# EAGLE design Dashboard_V3 (EAGLE 8.4.1)
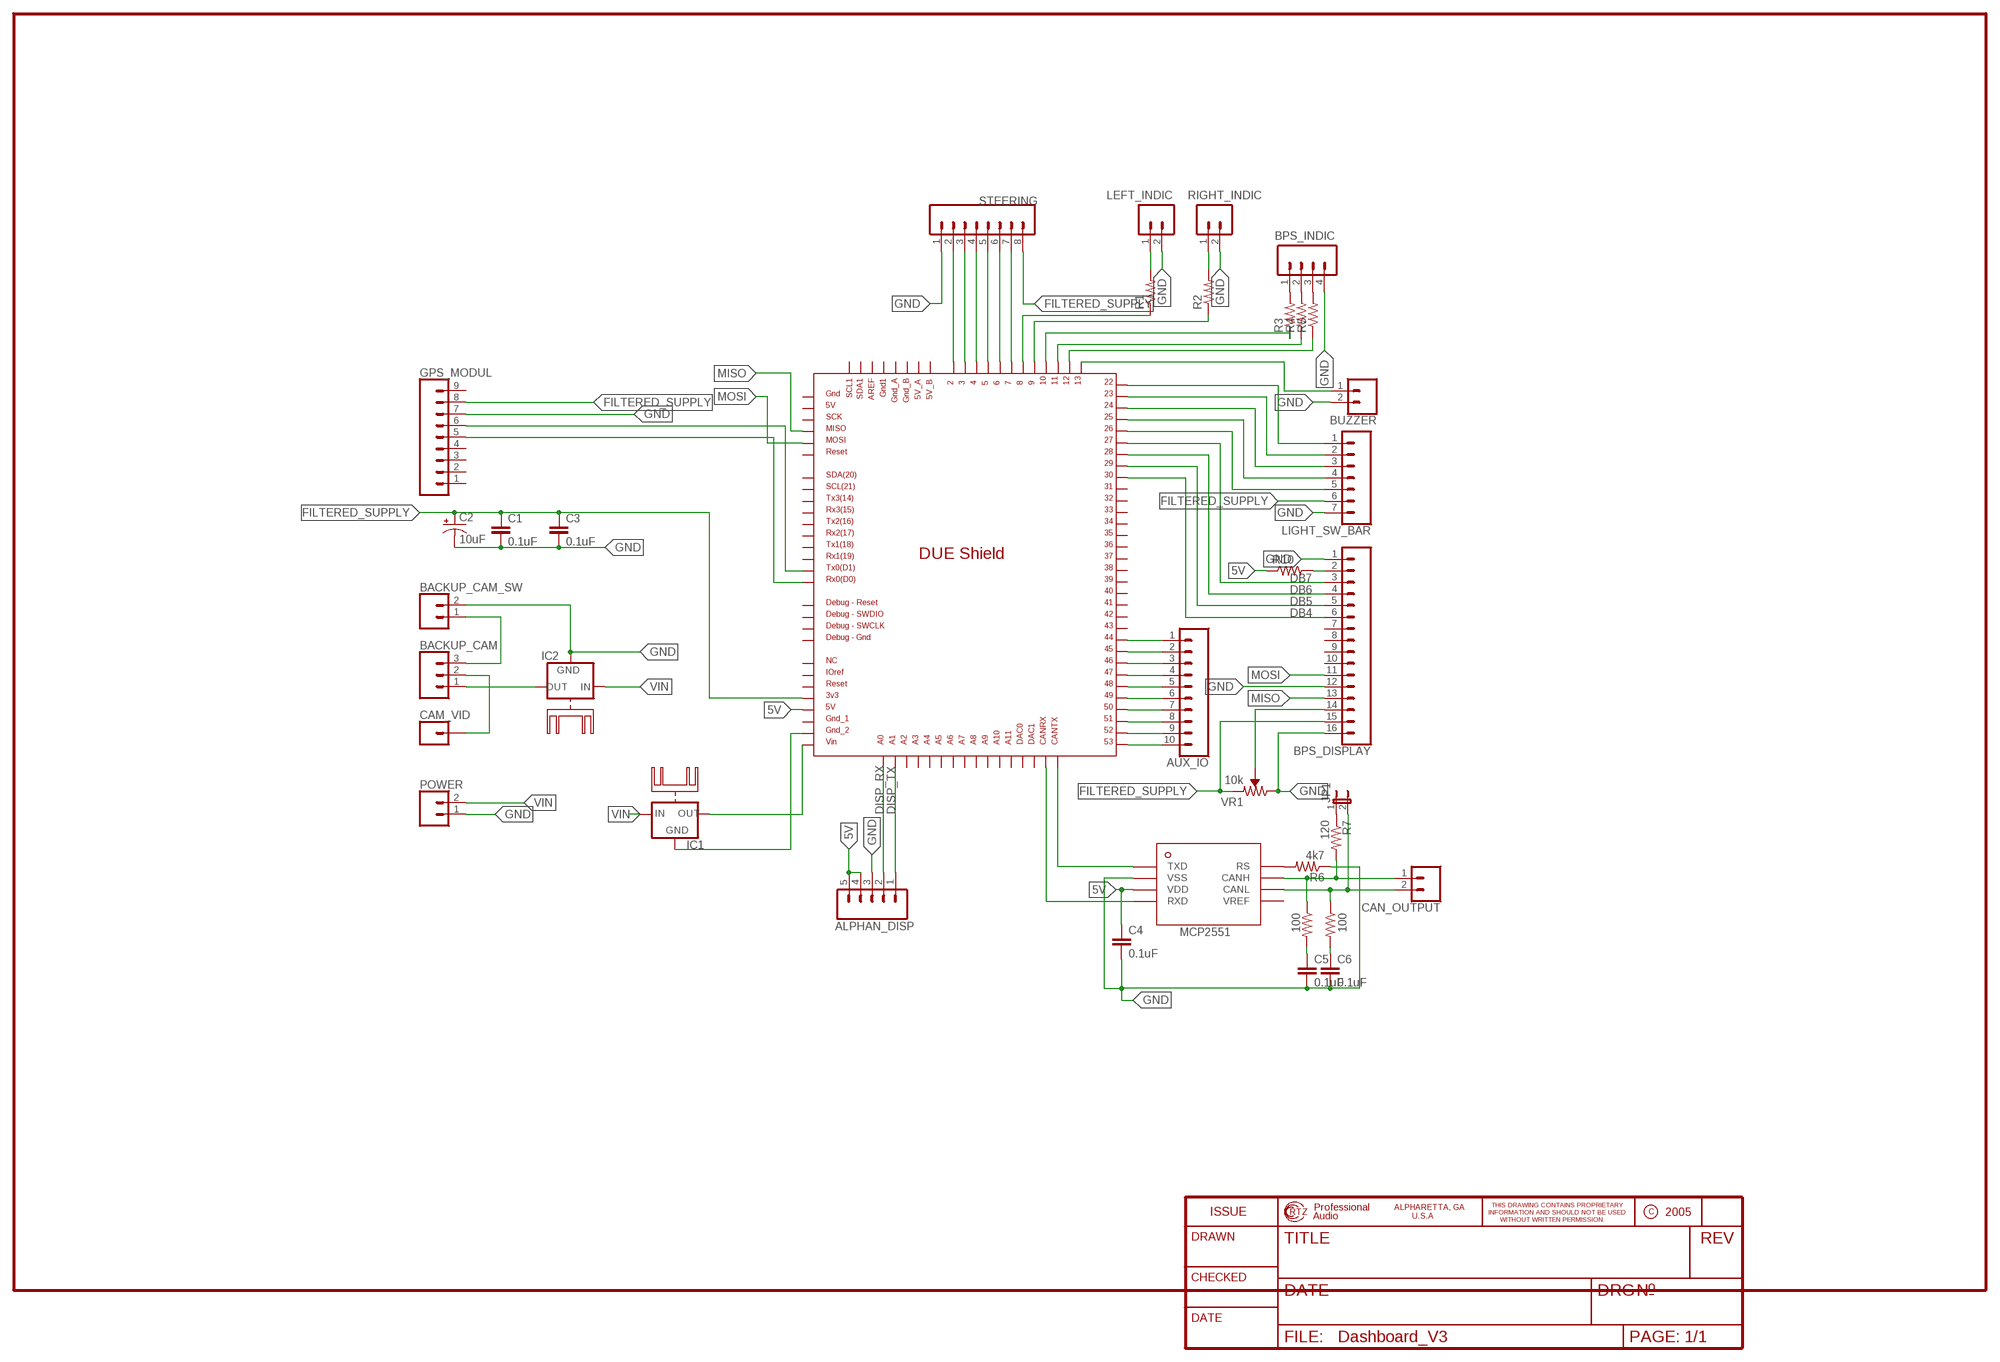
[diagram p0: schematic, sheet 1]

## Parts
ALPHAN_DISP  CONN_05  [1X05]
AUX_IO  CONN_10"  [1X10]
BACKUP_CAM  CONN_03  [1X03]
BACKUP_CAM_SW  CONN_02  [1X02]
BPS_DISPLAY  CONN_16  [1X16]
BPS_INDIC  CONN_04  [1X04]
BUZZER  CONN_02  [1X02]
C1  0.1uF  C2.5/6  [C2.5-6]
C2  10uF  CPOL-USE5-6  [E5-6]
C3  0.1uF  C2.5/6  [C2.5-6]
C4  0.1uF  C2.5/6  [C2.5-6]
C5  0.1uF  C2.5/6  [C2.5-6]
C6  0.1uF  C2.5/6  [C2.5-6]
CAM_VID  CONN_01  [1X01]
CAN_OUTPUT  CONN_025MM  [SCREWTERMINAL-5MM-2]
GPS_MODUL  CONN_09  [1X09]
IC1  78XXH  [78XXH]
IC2  78XXH  [78XXH]
JP1  JP1E  [JP1]
LEFT_INDIC  CONN_02  [1X02]
LIGHT_SW_BAR  CONN_07  [1X07]
POWER  CONN_02  [1X02]
R1  R-US_M0805  [M0805]
R2  R-US_M0805  [M0805]
R3  R-US_M0805  [M0805]
R4  R-US_M0805  [M0805]
R5  R-US_M0805  [M0805]
R6  4k7  R-US_R0805  [R0805]
R7  120  R-US_R0805  [R0805]
R8  100  R-US_R0805  [R0805]
R9  100  R-US_R0805  [R0805]
R10  R-US_R0805  [R0805]
RIGHT_INDIC  CONN_02  [1X02]
STEERING  CONN_08"  [1X08]
U$1  DUE(NORMAL)  [DUE(NORMAL)]
U$2  MCP2551  [SOIC-8]
VR1  10k  TRIMPOT-PTH-10MM-KNOB-1/2W-10%  [TRIMPOT-PTH-3386U]

## Nets
5V: ALPHAN_DISP.4 ALPHAN_DISP.5 C4.1 R10.1 U$1.5V U$2.VDD
CAM_VID: BACKUP_CAM.2 CAM_VID.1
DB4: BPS_DISPLAY.6 U$1.30
DB5: BPS_DISPLAY.5 U$1.29
DB6: BPS_DISPLAY.4 U$1.28
DB7: BPS_DISPLAY.3 U$1.27
DISP_RX: ALPHAN_DISP.2 U$1.A0
DISP_TX: ALPHAN_DISP.1 U$1.A1
FILTERED_SUPPLY: BPS_DISPLAY.15 C1.1 C2.+ C3.1 GPS_MODUL.8 LIGHT_SW_BAR.6 STEERING.8 U$1.3V3 VR1.1(CCW)
GND: ALPHAN_DISP.3 BACKUP_CAM_SW.2 BPS_DISPLAY.1 BPS_DISPLAY.12 BPS_DISPLAY.16 BPS_INDIC.4 BUZZER.2 C1.2 C2.- C3.2 C4.2 C5.2 C6.2 GPS_MODUL.7 IC2.GND LEFT_INDIC.2 LIGHT_SW_BAR.7 POWER.1 R6.1 RIGHT_INDIC.2 STEERING.1 U$2.VSS VR1.3(CW)
MISO: BPS_DISPLAY.13 U$1.MISO_ICSP
MOSI: BPS_DISPLAY.11 U$1.MOSI_ICSP
N$1: IC1.OUT U$1.VIN
N$2: IC1.GND U$1.GND_2
N$3: BACKUP_CAM.1 IC2.OUT
N$4: STEERING.2 U$1.2
N$5: BACKUP_CAM.3 BACKUP_CAM_SW.1
N$6: STEERING.3 U$1.3
N$7: STEERING.4 U$1.4
N$8: STEERING.5 U$1.5
N$9: STEERING.6 U$1.6
N$10: STEERING.7 U$1.7
N$12: LEFT_INDIC.1 R1.2
N$13: R2.2 RIGHT_INDIC.1
N$14: R1.1 U$1.8
N$15: R2.1 U$1.9
N$16: BPS_INDIC.1 R3.2
N$17: BPS_INDIC.2 R4.2
N$18: BPS_INDIC.3 R5.2
N$19: R3.1 U$1.10
N$20: R4.1 U$1.11
N$21: R5.1 U$1.12
N$22: U$1.CANTX U$2.TXD
N$23: U$1.CANRX U$2.RXD
N$24: R6.2 U$2.RS
N$25: JP1.1 R7.1
N$26: CAN_OUTPUT.1 R7.2 R8.1 U$2.CANH
N$27: CAN_OUTPUT.2 JP1.2 R9.1 U$2.CANL
N$28: C5.1 R8.2
N$29: C6.1 R9.2
N$30: BUZZER.1 U$1.13
N$31: GPS_MODUL.6 U$1.TX0
N$32: GPS_MODUL.5 U$1.RX0
N$33: BPS_DISPLAY.2 R10.2
N$34: BPS_DISPLAY.14 VR1.2(WIPER)
N$35: LIGHT_SW_BAR.1 U$1.22
N$36: LIGHT_SW_BAR.2 U$1.23
N$37: LIGHT_SW_BAR.3 U$1.24
N$38: LIGHT_SW_BAR.4 U$1.25
N$39: LIGHT_SW_BAR.5 U$1.26
N$40: AUX_IO.10 U$1.53
N$41: AUX_IO.9 U$1.52
N$42: AUX_IO.8 U$1.51
N$43: AUX_IO.7 U$1.50
N$44: AUX_IO.6 U$1.49
N$45: AUX_IO.5 U$1.48
N$46: AUX_IO.4 U$1.47
N$47: AUX_IO.3 U$1.46
N$48: AUX_IO.2 U$1.45
N$49: AUX_IO.1 U$1.44
VIN: IC1.IN IC2.IN POWER.2
Unconnected: BPS_DISPLAY.7 BPS_DISPLAY.8 BPS_DISPLAY.9 BPS_DISPLAY.10 GPS_MODUL.1 GPS_MODUL.2 GPS_MODUL.3 GPS_MODUL.4 GPS_MODUL.9 U$1.5V_A U$1.5V_B U$1.5V_ICSP U$1.31 U$1.32 U$1.33 U$1.34 U$1.35 U$1.36 U$1.37 U$1.38 U$1.39 U$1.40 U$1.41 U$1.42 U$1.43 U$1.A2 U$1.A3 U$1.A4 U$1.A5 U$1.A6 U$1.A7 U$1.A8 U$1.A9 U$1.A10 U$1.A11 U$1.AREF U$1.DAC0 U$1.DAC1 U$1.GND1 U$1.GND_1 U$1.GND_A U$1.GND_B U$1.GND_DEBUG U$1.GND_ICSP U$1.IOREF U$1.NC U$1.RESET U$1.RESET_DEBUG U$1.RESET_ICSP U$1.RX1 U$1.RX2 U$1.RX3 U$1.SCK_ICSP U$1.SCL U$1.SCL1 U$1.SDA U$1.SDA1 U$1.SWCLK_DEBUG U$1.SWDIO_DEBUG U$1.TX1 U$1.TX2 U$1.TX3 U$2.VREF

## Library data of the parts
ALPHAN_DISP = SparkFun-Connectors:CONN_05: Multi connection point. Often used as Generic Header-pin footprint for 0.1 inch spaced/style header connections On any of the 0.1 inch spaced packages, you can populate with these: Break Away Headers - Straight <https://www.sparkfun.com/products/116> (PRT-00116) Break Away Male Headers - Right Angle <https://www.sparkfun.com/products/553> (PRT-00553) Female Headers <https://www.sparkfun.com/products/115> (PRT-00115) Break Away Headers - Machine Pin <https://www.sparkfun.com/products/117> (PRT-00117) Break Away Female Headers - Swiss Machine Pin <https://www.sparkfun.com/products/743> (PRT-00743) For SCREWTERMINALS and SPRING TERMINALS visit here: Screw Terimnals on SparkFun.com <https://www.sparkfun.com/search/results?term=Screw+Terminals> (5mm/3.5mm/2.54mm spacing) This device is also useful as a general connection point to wire up your design to another part of your project. Our various solder wires solder well into these plated through hole pads. Hook-Up Wire - Assortment (Stranded, 22 AWG) <https://www.sparkfun.com/products/11375> (PRT-11375) Hook-Up Wire - Assortment (Solid Core, 22 AWG) <https://www.sparkfun.com/products/11367> (PRT-11367) View the entire wire category on our website here <https://www.sparkfun.com/categories/141> Special notes: Molex polarized connector foot print use with SKU : PRT-08231 with associated crimp pins and housings. 1MM SMD Version SKU: PRT-10208
AUX_IO = SparkFun-Connectors:CONN_10: Multi connection point. Often used as Generic Header-pin footprint for 0.1 inch spaced/style header connections On any of the 0.1 inch spaced packages, you can populate with these: Break Away Headers - Straight <https://www.sparkfun.com/products/116> (PRT-00116) Break Away Male Headers - Right Angle <https://www.sparkfun.com/products/553> (PRT-00553) Female Headers <https://www.sparkfun.com/products/115> (PRT-00115) Break Away Headers - Machine Pin <https://www.sparkfun.com/products/117> (PRT-00117) Break Away Female Headers - Swiss Machine Pin <https://www.sparkfun.com/products/743> (PRT-00743) Arduino Stackable Header - 10 Pin <https://www.sparkfun.com/products/11376> (PRT-11376) For SCREWTERMINALS and SPRING TERMINALS visit here: Screw Terimnals on SparkFun.com <https://www.sparkfun.com/search/results?term=Screw+Terminals> (5mm/3.5mm/2.54mm spacing) This device is also useful as a general connection point to wire up your design to another part of your project. Our various solder wires solder well into these plated through hole pads. Hook-Up Wire - Assortment (Stranded, 22 AWG) <https://www.sparkfun.com/products/11375> (PRT-11375) Hook-Up Wire - Assortment (Solid Core, 22 AWG) <https://www.sparkfun.com/products/11367> (PRT-11367) View the entire wire category on our website here <https://www.sparkfun.com/categories/141> Special notes: Molex polarized connector foot print use with SKU : PRT-08231 with associated crimp pins and housings. 1MM SMD Version SKU: PRT-10208 NOTES ON THE VARIANTS LOCK and LOCK_LONGPADS... This footprint was designed to help hold the alignment of a through-hole component (i.e. 6-pin header) while soldering it into place. You may notice that each hole has been shifted either up or down by 0.005 of an inch from it's more standard position (which is a perfectly straight line). This slight alteration caused the pins (the squares in the middle) to touch the edges of the holes. Because they are alternating, it causes a "brace" to hold the component in place. 0.005 has proven to be the perfect amount of "off-center" position when using our standard breakaway headers. Although looks a little odd when you look at the bare footprint, once you have a header in there, the alteration is very hard to notice. Also,if you push a header all the way into place, it is covered up entirely on the bottom side.; PROD_ID: CONN-11563
BACKUP_CAM = SparkFun-Connectors:CONN_03: Multi connection point. Often used as Generic Header-pin footprint for 0.1 inch spaced/style header connections On any of the 0.1 inch spaced packages, you can populate with these: Break Away Headers - Straight <https://www.sparkfun.com/products/116> (PRT-00116) Break Away Male Headers - Right Angle <https://www.sparkfun.com/products/553> (PRT-00553) Female Headers <https://www.sparkfun.com/products/115> (PRT-00115) Break Away Headers - Machine Pin <https://www.sparkfun.com/products/117> (PRT-00117) Break Away Female Headers - Swiss Machine Pin <https://www.sparkfun.com/products/743> (PRT-00743) Stackable Header - 3 Pin (Female, 0.1") <https://www.sparkfun.com/products/13875> (PRT-13875) For SCREWTERMINALS and SPRING TERMINALS visit here: Screw Terimnals on SparkFun.com <https://www.sparkfun.com/search/results?term=Screw+Terminals> (5mm/3.5mm/2.54mm spacing) This device is also useful as a general connection point to wire up your design to another part of your project. Our various solder wires solder well into these plated through hole pads. Hook-Up Wire - Assortment (Stranded, 22 AWG) <https://www.sparkfun.com/products/11375> (PRT-11375) Hook-Up Wire - Assortment (Solid Core, 22 AWG) <https://www.sparkfun.com/products/11367> (PRT-11367) View the entire wire category on our website here <https://www.sparkfun.com/categories/141> Special notes: Molex polarized connector foot print use with SKU : PRT-08232 with associated crimp pins and housings.
BACKUP_CAM_SW BUZZER LEFT_INDIC POWER RIGHT_INDIC = SparkFun-Connectors:CONN_02: Multi connection point. Often used as Generic Header-pin footprint for 0.1 inch spaced/style header connections On any of the 0.1 inch spaced packages, you can populate with these: Break Away Headers - Straight <https://www.sparkfun.com/products/116> (PRT-00116) Break Away Male Headers - Right Angle <https://www.sparkfun.com/products/553> (PRT-00553) Female Headers <https://www.sparkfun.com/products/115> (PRT-00115) Break Away Headers - Machine Pin <https://www.sparkfun.com/products/117> (PRT-00117) Break Away Female Headers - Swiss Machine Pin <https://www.sparkfun.com/products/743> (PRT-00743) For SCREWTERMINALS and SPRING TERMINALS visit here: Screw Terimnals on SparkFun.com <https://www.sparkfun.com/search/results?term=Screw+Terminals> (5mm/3.5mm/2.54mm spacing) This device is also useful as a general connection point to wire up your design to another part of your project. Our various solder wires solder well into these plated through hole pads. Hook-Up Wire - Assortment (Stranded, 22 AWG) <https://www.sparkfun.com/products/11375> (PRT-11375) Hook-Up Wire - Assortment (Solid Core, 22 AWG) <https://www.sparkfun.com/products/11367> (PRT-11367) View the entire wire category on our website here <https://www.sparkfun.com/categories/141> Special notes: Molex polarized connector foot print use with: PRT-08233 with associated crimp pins and housings. 2.54_SCREWTERM for use with PRT-10571. 3.5mm Screw Terminal footprints for PRT-08084 5mm Screw Terminal footprints for use with PRT-08432
BPS_DISPLAY = SparkFun-Connectors:CONN_16: Multi connection point. Often used as Generic Header-pin footprint for 0.1 inch spaced/style header connections On any of the 0.1 inch spaced packages, you can populate with these: Break Away Headers - Straight <https://www.sparkfun.com/products/116> (PRT-00116) Break Away Male Headers - Right Angle <https://www.sparkfun.com/products/553> (PRT-00553) Female Headers <https://www.sparkfun.com/products/115> (PRT-00115) Break Away Headers - Machine Pin <https://www.sparkfun.com/products/117> (PRT-00117) Break Away Female Headers - Swiss Machine Pin <https://www.sparkfun.com/products/743> (PRT-00743) For SCREWTERMINALS and SPRING TERMINALS visit here: Screw Terimnals on SparkFun.com <https://www.sparkfun.com/search/results?term=Screw+Terminals> (5mm/3.5mm/2.54mm spacing) This device is also useful as a general connection point to wire up your design to another part of your project. Our various solder wires solder well into these plated through hole pads. Hook-Up Wire - Assortment (Stranded, 22 AWG) <https://www.sparkfun.com/products/11375> (PRT-11375) Hook-Up Wire - Assortment (Solid Core, 22 AWG) <https://www.sparkfun.com/products/11367> (PRT-11367) View the entire wire category on our website here <https://www.sparkfun.com/categories/141> Special notes: Molex polarized connector foot print use with SKU : PRT-08231 with associated crimp pins and housings. 1MM SMD Version SKU: PRT-10208 NOTES ON THE VARIANTS LOCK and LOCK_LONGPADS... This footprint was designed to help hold the alignment of a through-hole component (i.e. 6-pin header) while soldering it into place. You may notice that each hole has been shifted either up or down by 0.005 of an inch from it's more standard position (which is a perfectly straight line). This slight alteration caused the pins (the squares in the middle) to touch the edges of the holes. Because they are alternating, it causes a "brace" to hold the component in place. 0.005 has proven to be the perfect amount of "off-center" position when using our standard breakaway headers. Although looks a little odd when you look at the bare footprint, once you have a header in there, the alteration is very hard to notice. Also,if you push a header all the way into place, it is covered up entirely on the bottom side.
BPS_INDIC = SparkFun-Connectors:CONN_04: Multi connection point. Often used as Generic Header-pin footprint for 0.1 inch spaced/style header connections On any of the 0.1 inch spaced packages, you can populate with these: Break Away Headers - Straight <https://www.sparkfun.com/products/116> (PRT-00116) Break Away Male Headers - Right Angle <https://www.sparkfun.com/products/553> (PRT-00553) Female Headers <https://www.sparkfun.com/products/115> (PRT-00115) Break Away Headers - Machine Pin <https://www.sparkfun.com/products/117> (PRT-00117) Break Away Female Headers - Swiss Machine Pin <https://www.sparkfun.com/products/743> (PRT-00743) For SCREWTERMINALS and SPRING TERMINALS visit here: Screw Terimnals on SparkFun.com <https://www.sparkfun.com/search/results?term=Screw+Terminals> (5mm/3.5mm/2.54mm spacing) This device is also useful as a general connection point to wire up your design to another part of your project. Our various solder wires solder well into these plated through hole pads. Hook-Up Wire - Assortment (Stranded, 22 AWG) <https://www.sparkfun.com/products/11375> (PRT-11375) Hook-Up Wire - Assortment (Solid Core, 22 AWG) <https://www.sparkfun.com/products/11367> (PRT-11367) View the entire wire category on our website here <https://www.sparkfun.com/categories/141> Special notes: Molex polarized connector foot print use with SKU : PRT-08231 with associated crimp pins and housings. 1MM SMD Version SKU: PRT-10208; PROD_ID: CONN-09696
C1 C3-C6 = capacitor-wima:C: CAPACITOR naming: grid - package width
C2 = adafruit:CPOL-US: POLARIZED CAPACITOR, American symbol
CAM_VID = SparkFun-Connectors:CONN_01: Single connection point. Often used as Generic Header-pin footprint for 0.1 inch spaced/style header connections On any of the 0.1 inch spaced packages, you can populate with these: Break Away Headers - Straight <https://www.sparkfun.com/products/116> (PRT-00116) Break Away Male Headers - Right Angle <https://www.sparkfun.com/products/553> (PRT-00553) Female Headers <https://www.sparkfun.com/products/115> (PRT-00115) Break Away Headers - Machine Pin <https://www.sparkfun.com/products/117> (PRT-00117) Break Away Female Headers - Swiss Machine Pin <https://www.sparkfun.com/products/743> (PRT-00743) This device is also useful as a general connection point to wire up your design to another part of your project. Our various solder wires solder well into these plated through hole pads. Hook-Up Wire - Assortment (Stranded, 22 AWG) <https://www.sparkfun.com/products/11375> (PRT-11375) Hook-Up Wire - Assortment (Solid Core, 22 AWG) <https://www.sparkfun.com/products/11367> (PRT-11367) View the entire wire category on our website here <https://www.sparkfun.com/categories/141> Special notes: SMTSO-256-ET is a "flush mount" nut for a 4-40 screw. We mostly use this on specialty testbeds; it is a nice way to connect hardware to your PCB at an adjustable hieght. Also note, the SNAP packages are for using a snappable style connector. We sell a baggie of snaps and they are also used on two LilyPad designs: Snap Assortment - 30 pack (male and female) <https://www.sparkfun.com/products/11347> (DEV-11347) LilyPad Arduino SimpleSnap <https://www.sparkfun.com/products/10941> (DEV-10941) LilyPad SimpleSnap Protoboard <https://www.sparkfun.com/products/10940> (DEV-10940)
CAN_OUTPUT = SparkFun-Connectors:CONN_02: Multi connection point. Often used as Generic Header-pin footprint for 0.1 inch spaced/style header connections On any of the 0.1 inch spaced packages, you can populate with these: Break Away Headers - Straight <https://www.sparkfun.com/products/116> (PRT-00116) Break Away Male Headers - Right Angle <https://www.sparkfun.com/products/553> (PRT-00553) Female Headers <https://www.sparkfun.com/products/115> (PRT-00115) Break Away Headers - Machine Pin <https://www.sparkfun.com/products/117> (PRT-00117) Break Away Female Headers - Swiss Machine Pin <https://www.sparkfun.com/products/743> (PRT-00743) For SCREWTERMINALS and SPRING TERMINALS visit here: Screw Terimnals on SparkFun.com <https://www.sparkfun.com/search/results?term=Screw+Terminals> (5mm/3.5mm/2.54mm spacing) This device is also useful as a general connection point to wire up your design to another part of your project. Our various solder wires solder well into these plated through hole pads. Hook-Up Wire - Assortment (Stranded, 22 AWG) <https://www.sparkfun.com/products/11375> (PRT-11375) Hook-Up Wire - Assortment (Solid Core, 22 AWG) <https://www.sparkfun.com/products/11367> (PRT-11367) View the entire wire category on our website here <https://www.sparkfun.com/categories/141> Special notes: Molex polarized connector foot print use with: PRT-08233 with associated crimp pins and housings. 2.54_SCREWTERM for use with PRT-10571. 3.5mm Screw Terminal footprints for PRT-08084 5mm Screw Terminal footprints for use with PRT-08432; SF_SKU: PRT-08432
GPS_MODUL = SparkFun-Connectors:CONN_09: Multi connection point. Often used as Generic Header-pin footprint for 0.1 inch spaced/style header connections On any of the 0.1 inch spaced packages, you can populate with these: Break Away Headers - Straight <https://www.sparkfun.com/products/116> (PRT-00116) Break Away Male Headers - Right Angle <https://www.sparkfun.com/products/553> (PRT-00553) Female Headers <https://www.sparkfun.com/products/115> (PRT-00115) Break Away Headers - Machine Pin <https://www.sparkfun.com/products/117> (PRT-00117) Break Away Female Headers - Swiss Machine Pin <https://www.sparkfun.com/products/743> (PRT-00743) For SCREWTERMINALS and SPRING TERMINALS visit here: Screw Terimnals on SparkFun.com <https://www.sparkfun.com/search/results?term=Screw+Terminals> (5mm/3.5mm/2.54mm spacing) This device is also useful as a general connection point to wire up your design to another part of your project. Our various solder wires solder well into these plated through hole pads. Hook-Up Wire - Assortment (Stranded, 22 AWG) <https://www.sparkfun.com/products/11375> (PRT-11375) Hook-Up Wire - Assortment (Solid Core, 22 AWG) <https://www.sparkfun.com/products/11367> (PRT-11367) View the entire wire category on our website here <https://www.sparkfun.com/categories/141> Special notes: Molex polarized connector foot print use with SKU : PRT-08231 with associated crimp pins and housings. 1MM SMD Version SKU: PRT-10208 NOTES ON THE VARIANTS LOCK and LOCK_LONGPADS... This footprint was designed to help hold the alignment of a through-hole component (i.e. 6-pin header) while soldering it into place. You may notice that each hole has been shifted either up or down by 0.005 of an inch from it's more standard position (which is a perfectly straight line). This slight alteration caused the pins (the squares in the middle) to touch the edges of the holes. Because they are alternating, it causes a "brace" to hold the component in place. 0.005 has proven to be the perfect amount of "off-center" position when using our standard breakaway headers. Although looks a little odd when you look at the bare footprint, once you have a header in there, the alteration is very hard to notice. Also,if you push a header all the way into place, it is covered up entirely on the bottom side.
IC1 IC2 = 78xx_with_heatsink:78XXH: VOLTAGE REGULATOR
JP1 = jumper:JP1E: JUMPER
LIGHT_SW_BAR = SparkFun-Connectors:CONN_07: Multi connection point. Often used as Generic Header-pin footprint for 0.1 inch spaced/style header connections On any of the 0.1 inch spaced packages, you can populate with these: Break Away Headers - Straight <https://www.sparkfun.com/products/116> (PRT-00116) Break Away Male Headers - Right Angle <https://www.sparkfun.com/products/553> (PRT-00553) Female Headers <https://www.sparkfun.com/products/115> (PRT-00115) Break Away Headers - Machine Pin <https://www.sparkfun.com/products/117> (PRT-00117) Break Away Female Headers - Swiss Machine Pin <https://www.sparkfun.com/products/743> (PRT-00743) For SCREWTERMINALS and SPRING TERMINALS visit here: Screw Terimnals on SparkFun.com <https://www.sparkfun.com/search/results?term=Screw+Terminals> (5mm/3.5mm/2.54mm spacing) This device is also useful as a general connection point to wire up your design to another part of your project. Our various solder wires solder well into these plated through hole pads. Hook-Up Wire - Assortment (Stranded, 22 AWG) <https://www.sparkfun.com/products/11375> (PRT-11375) Hook-Up Wire - Assortment (Solid Core, 22 AWG) <https://www.sparkfun.com/products/11367> (PRT-11367) View the entire wire category on our website here <https://www.sparkfun.com/categories/141> Special notes: Molex polarized connector foot print use with SKU : PRT-08231 with associated crimp pins and housings. 1MM SMD Version SKU: PRT-10208 NOTES ON THE VARIANTS LOCK and LOCK_LONGPADS... This footprint was designed to help hold the alignment of a through-hole component (i.e. 6-pin header) while soldering it into place. You may notice that each hole has been shifted either up or down by 0.005 of an inch from it's more standard position (which is a perfectly straight line). This slight alteration caused the pins (the squares in the middle) to touch the edges of the holes. Because they are alternating, it causes a "brace" to hold the component in place. 0.005 has proven to be the perfect amount of "off-center" position when using our standard breakaway headers. Although looks a little odd when you look at the bare footprint, once you have a header in there, the alteration is very hard to notice. Also,if you push a header all the way into place, it is covered up entirely on the bottom side.
R1-R10 = adafruit:R-US_: RESISTOR, American symbol
STEERING = SparkFun-Connectors:CONN_08: Multi connection point. Often used as Generic Header-pin footprint for 0.1 inch spaced/style header connections On any of the 0.1 inch spaced packages, you can populate with these: Break Away Headers - Straight <https://www.sparkfun.com/products/116> (PRT-00116) Break Away Male Headers - Right Angle <https://www.sparkfun.com/products/553> (PRT-00553) Female Headers <https://www.sparkfun.com/products/115> (PRT-00115) Break Away Headers - Machine Pin <https://www.sparkfun.com/products/117> (PRT-00117) Break Away Female Headers - Swiss Machine Pin <https://www.sparkfun.com/products/743> (PRT-00743) Arduino Stackable Header - 8 Pin <https://www.sparkfun.com/products/9279> (PRT-09279) For SCREWTERMINALS and SPRING TERMINALS visit here: Screw Terimnals on SparkFun.com <https://www.sparkfun.com/search/results?term=Screw+Terminals> (5mm/3.5mm/2.54mm spacing) This device is also useful as a general connection point to wire up your design to another part of your project. Our various solder wires solder well into these plated through hole pads. Hook-Up Wire - Assortment (Stranded, 22 AWG) <https://www.sparkfun.com/products/11375> (PRT-11375) Hook-Up Wire - Assortment (Solid Core, 22 AWG) <https://www.sparkfun.com/products/11367> (PRT-11367) View the entire wire category on our website here <https://www.sparkfun.com/categories/141> Special notes: Molex polarized connector foot print use with SKU : PRT-08231 with associated crimp pins and housings. 1MM SMD Version SKU: PRT-10208 NOTES ON THE VARIANTS LOCK and LOCK_LONGPADS... This footprint was designed to help hold the alignment of a through-hole component (i.e. 6-pin header) while soldering it into place. You may notice that each hole has been shifted either up or down by 0.005 of an inch from it's more standard position (which is a perfectly straight line). This slight alteration caused the pins (the squares in the middle) to touch the edges of the holes. Because they are alternating, it causes a "brace" to hold the component in place. 0.005 has proven to be the perfect amount of "off-center" position when using our standard breakaway headers. Although looks a little odd when you look at the bare footprint, once you have a header in there, the alteration is very hard to notice. Also,if you push a header all the way into place, it is covered up entirely on the bottom side.; PROD_ID: CONN-08438
U$1 = DUElib130425:DUE(NORMAL)
U$2 = MCP2551:MCP2551: The MCP2551 is a high-speed CAN, fault-tolerant device that serves as the interface between a CAN protocol controller and the physical bus. The MCP2551 provides differential transmit and receive capability for the CAN protocol controller and is fully compatible with the ISO-11898 standard, including 24V requirements. It will operate at speeds of up to 1 Mb/s. Typically, each node in a CAN system must have a device to convert the digital signals generated by a CAN controller to signals suitable for transmission over the bus cabling (differential output). It also provides a buffer between the CAN controller and the high-voltage spikes that can be generated on the CAN bus by outside sources (EMI, ESD, electrical transients, etc.).
VR1 = SparkFun-Resistors:TRIMPOT: Trimming Potentiometer (Trimpot) Three-terminal potentiometers, with an adjustable wiper and two adjustable resistors. A pot can be used to create a configurable voltage divider, or as a variable resistor. "Trimpots" are a subset of potentiometers, usually intended for "set-and-forget" applications. They're often more delicate than standard potentiometers - rated for fewer turns. Variants PTH-KNOB - PTH Trimpot w/ finger-adjustable knob Trimpot 10K with Knob <https://www.sparkfun.com/products/9806> (COM-09806) Datasheet <http://www.sparkfun.com/datasheets/Components/General/TSR-3386.pdf> SMD-3MM-CLOSED-FRAME - SMD 3mm Square Closed-Frame Trimpot Used on e.g. EasyDriver - Stepper Motor Driver <https://www.sparkfun.com/products/12779> Datasheet <http://www.bitechnologies.com/pdfs/22.pdf> (22AR10KTR) SMD-5MM - SMD 5mm Square Closed-Frame Trimpot Used on e.g. IOIO-OTG - V2.2 <https://www.sparkfun.com/products/13613> Datasheet <http://www.vishay.com/docs/51008/ts53.pdf> (TS53YL502MR10) SMD-3MM-1/10W-25% - 3mm Square Open-Frame Trimpot Used on e.g. SparkFun Shapeoko <https://www.sparkfun.com/products/13899> Datasheet <http://www.bourns.com/docs/Product-Datasheets/TC33.pdf> (TC33X-2-103E); PROD_ID: RES-09730; SF_SKU: COM-09806

## Board
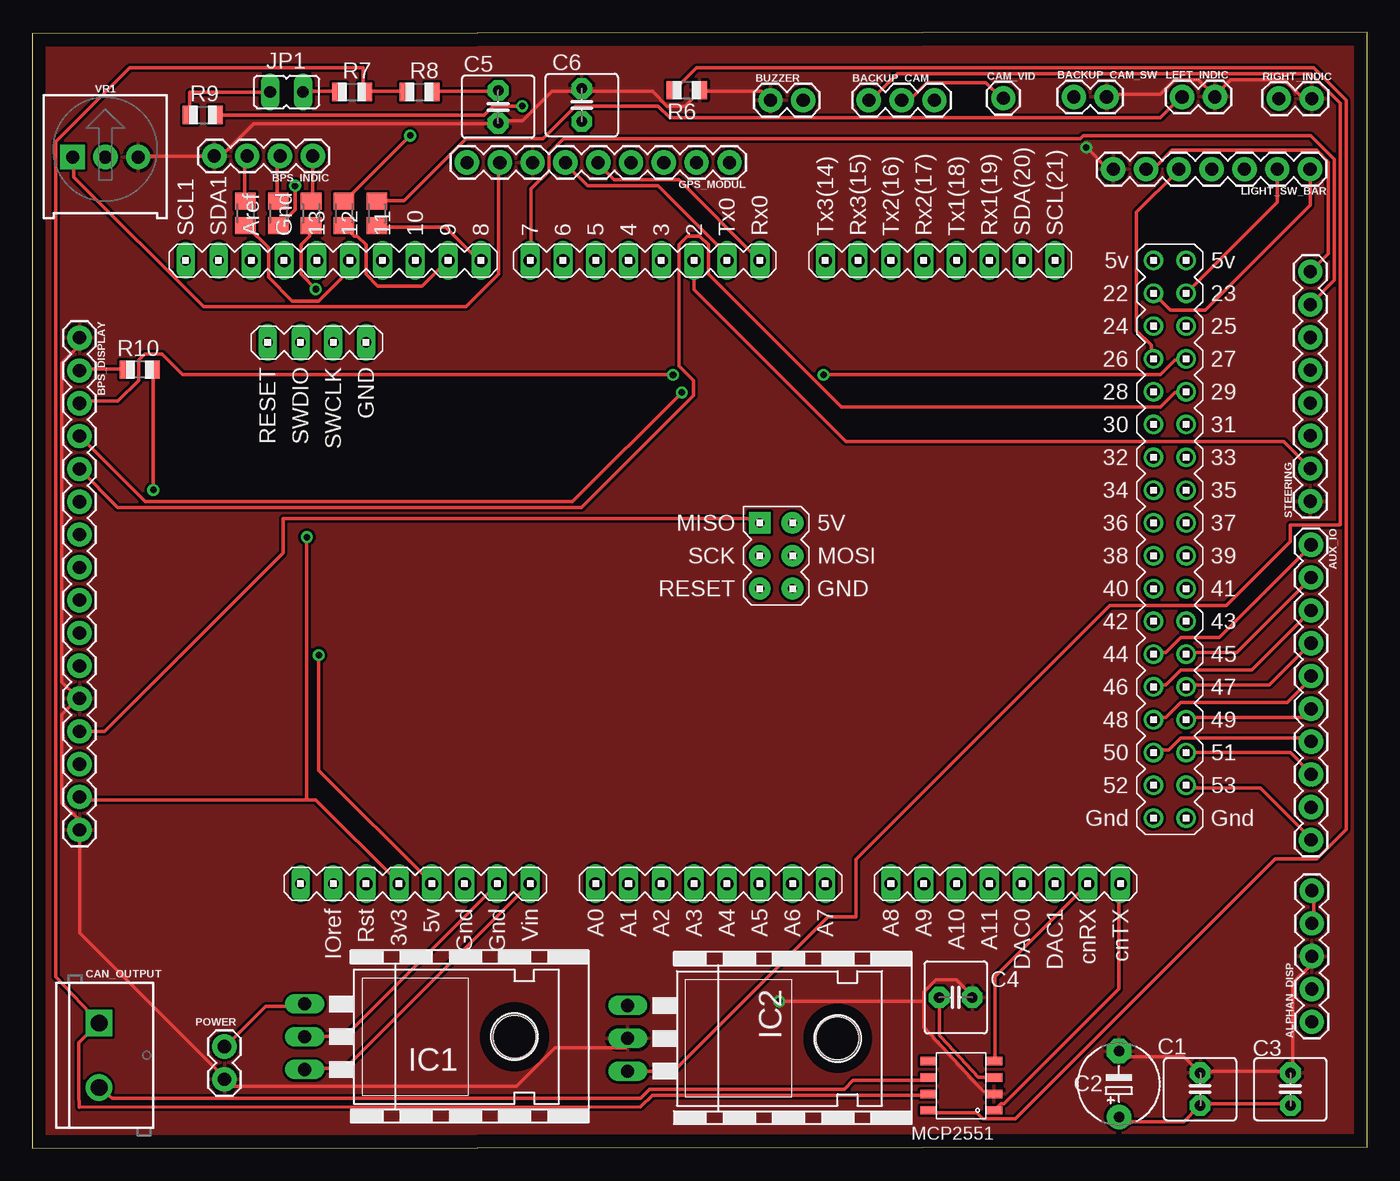
[diagram p1: board, top side]
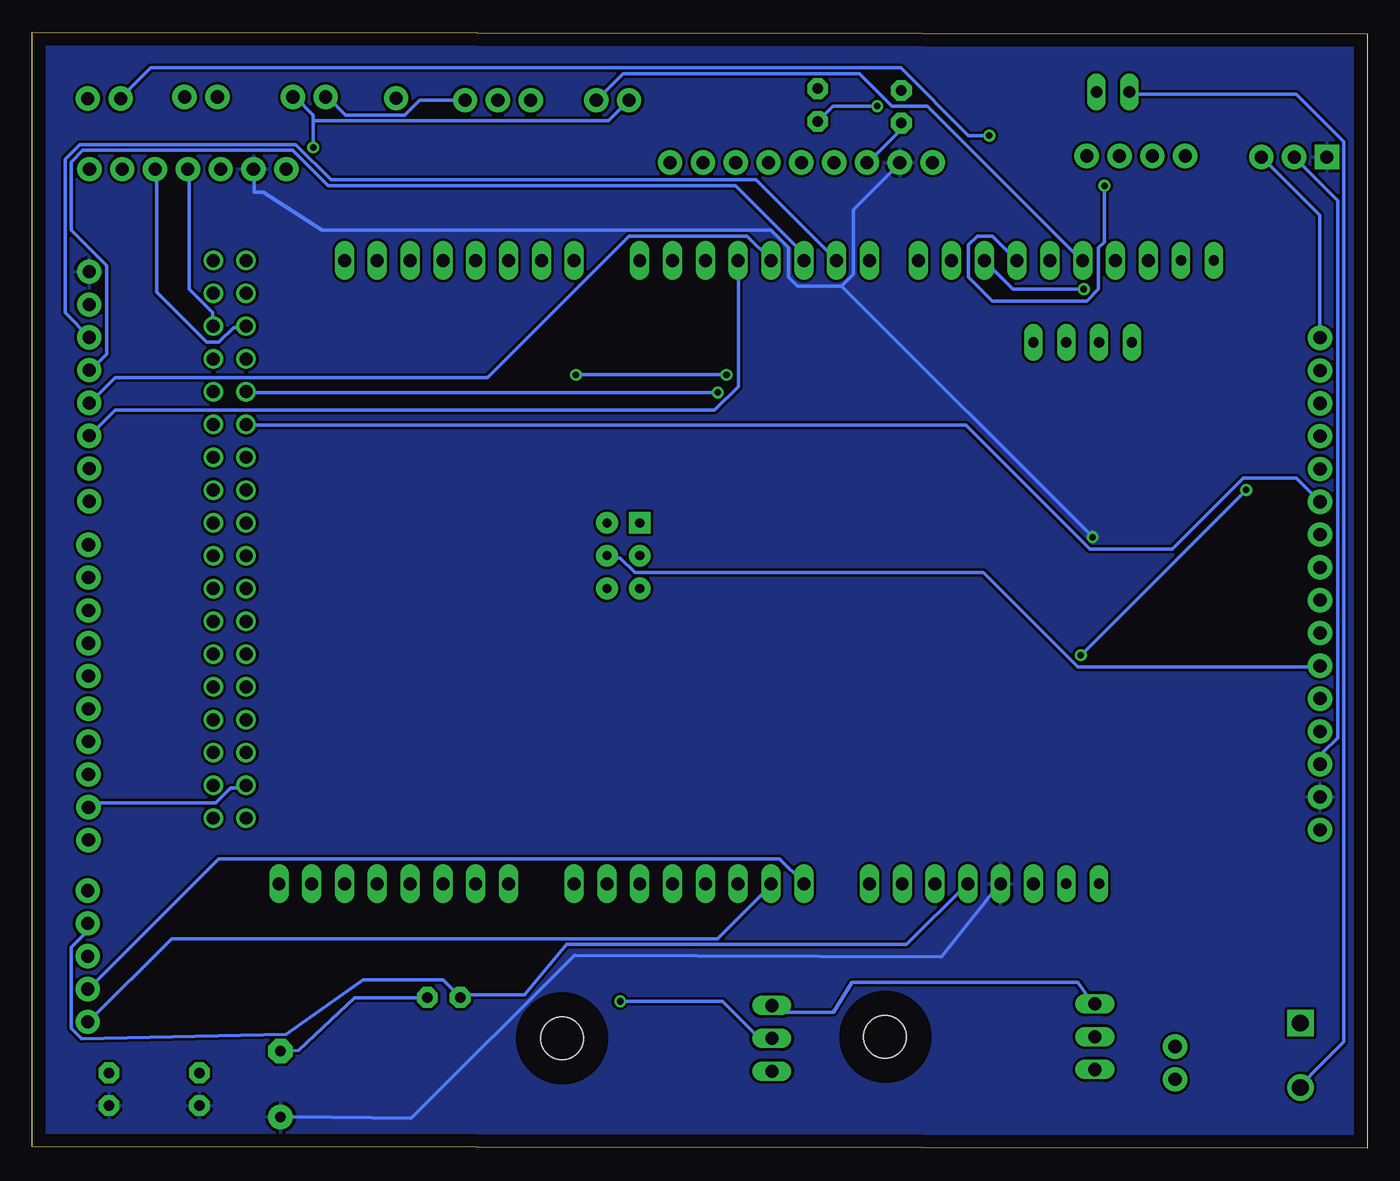
[diagram p2: board, bottom side, seen from below]

Size 103.36 x 86.41 mm. Coordinates in mm from the lower left corner, seen from the top.
Outline: 0,0 103.36,0.13 103.36,86.41 0,86.28 0,0
Copper layers (1*16): Top 0.035mm / dielectric 1.5mm / Bottom 0.035mm
Design rules "default *": minimum track width 10mil, minimum drill 20mil, track to track 8mil, track to pad 8mil, pad to pad 8mil, via to via 8mil, smd to smd 8mil, copper to edge 40mil, drill to drill 8mil, minimum pad ring 10mil, minimum via ring 8mil, stop-mask expansion 4mil, vias tented up to drill 0mil, thermal gap 10mil

### Footprints (pad centres in the part's own frame; a part is rotated, then mirrored left to right if it is on the bottom)
1X05 = drill 1.016 pad 1.88: 1 0,0; 2 2.54,0; 3 5.08,0; 4 7.62,0; 5 10.16,0
1X10 = drill 1.016 pad 1.88: 1 0,0; 2 2.54,0; 3 5.08,0; 4 7.62,0; 5 10.16,0; 6 12.7,0; 7 15.24,0; 8 17.78,0; 9 20.32,0; 10 22.86,0
1X03 = drill 1.016 pad 1.88: 1 0,0; 2 2.54,0; 3 5.08,0
1X02 = drill 1.016 pad 1.88: 1 0,0; 2 2.54,0
1X16 = drill 1.016 pad 1.88: 1 0,0; 2 2.54,0; 3 5.08,0; 4 7.62,0; 5 10.16,0; 6 12.7,0; 7 15.24,0; 8 17.78,0; 9 20.32,0; 10 22.86,0; 11 25.4,0; 12 27.94,0; 13 30.48,0; 14 33.02,0; 15 35.56,0; 16 38.1,0
1X04 = drill 1.016 pad 1.88: 1 0,0; 2 2.54,0; 3 5.08,0; 4 7.62,0
C2.5-6 = drill 0.813 pad 1.6 octagon: 1 -1.27,0; 2 1.27,0
E5-6 = drill 0.813 pad 1.905: + -2.54,0 | drill 0.813 pad 1.905 octagon: - 2.54,0
1X01 = drill 1.016 pad 1.88: 1 0,0
SCREWTERMINAL-5MM-2 = drill 1.3 pad 2.032 square: 1 0,0 | drill 1.3 pad 2.032: 2 5,0
1X09 = drill 1.016 pad 1.88: 1 0,0; 2 2.54,0; 3 5.08,0; 4 7.62,0; 5 10.16,0; 6 12.7,0; 7 15.24,0; 8 17.78,0; 9 20.32,0
78XXH = drill 1.016 long: GND 0,-5.08; IN -2.54,-5.08; OUT 2.54,-5.08 | hole 3.302: 0,11.176
JP1 = drill 0.914 long: 1 0,-1.27; 2 0,1.27
1X07 = drill 1.016 pad 1.88: 1 0,0; 2 2.54,0; 3 5.08,0; 4 7.62,0; 5 10.16,0; 6 12.7,0; 7 15.24,0
M0805 = smd 1.3 x 1.6: 1 -0.95,0; 2 0.95,0
R0805 = smd 1.1 x 1.4: 1 -1,0; 2 1,0
1X08 = drill 1.016 pad 1.88: 1 0,0; 2 2.54,0; 3 5.08,0; 4 7.62,0; 5 10.16,0; 6 12.7,0; 7 15.24,0; 8 17.78,0
DUE(NORMAL) = drill 1 long: 2 -16.51,30.48; 3 -19.05,30.48; 3V3 -39.37,-17.78; 4 -21.59,30.48; 5 -24.13,30.48; 5V -36.83,-17.78; 6 -26.67,30.48; 7 -29.21,30.48; 8 -33.02,30.48; 9 -35.56,30.48; 10 -38.1,30.48; 11 -40.64,30.48; 12 -43.18,30.48; 13 -45.72,30.48; A0 -24.13,-17.78; A1 -21.59,-17.78; A2 -19.05,-17.78; A3 -16.51,-17.78; A4 -13.97,-17.78; A5 -11.43,-17.78; A6 -8.89,-17.78; A7 -6.35,-17.78; A8 -1.27,-17.78; A9 1.27,-17.78; A10 3.81,-17.78; A11 6.35,-17.78; AREF -50.8,30.48; AREF1 -50.8,30.48; CANRX 13.97,-17.78; CANTX 16.51,-17.78; DAC0 8.89,-17.78; DAC1 11.43,-17.78; GND1 -48.26,30.48; GND_1 -34.29,-17.78; GND_2 -31.75,-17.78; RESET -41.91,-17.78; RX0 -11.43,30.48; RX1 6.35,30.48; RX2 1.27,30.48; RX3 -3.81,30.48; SCL 11.43,30.48; SDA 8.89,30.48; TX0 -13.97,30.48; TX1 3.81,30.48; TX2 -1.27,30.48; TX3 -6.35,30.48; VIN -29.21,-17.78 | drill 1: 5V_A 19.05,30.48; 5V_B 21.59,30.48; 22 19.05,27.94; 23 21.59,27.94; 24 19.05,25.4; 25 21.59,25.4; 26 19.05,22.86; 27 21.59,22.86; 28 19.05,20.32; 29 21.59,20.32; 30 19.05,17.78; 31 21.59,17.78; 32 19.05,15.24; 33 21.59,15.24; 34 19.05,12.7; 35 21.59,12.7; 36 19.05,10.16; 37 21.59,10.16; 38 19.05,7.62; 39 21.59,7.62; 40 19.05,5.08; 41 21.59,5.08; 42 19.05,2.54; 43 21.59,2.54; 44 19.05,0; 45 21.59,0; 46 19.05,-2.54; 47 21.59,-2.54; 48 19.05,-5.08; 49 21.59,-5.08; 50 19.05,-7.62; 51 21.59,-7.62; 52 19.05,-10.16; 53 21.59,-10.16; GND_A 19.05,-12.7; GND_B 21.59,-12.7 | drill 0.7 pad 1.676: 5V_ICSP -8.89,5.08; GND_ICSP -8.89,10.16; MOSI_ICSP -8.89,7.62; RESET_ICSP -11.43,5.08; SCK_ICSP -11.43,7.62 | drill 0.8 pad 1.422 long: GND_DEBUG -41.91,24.13; IOREF -44.45,-17.78; NC -46.99,-17.78; RESET_DEBUG -49.53,24.13; SCL1 -55.88,30.48; SDA1 -53.34,30.48; SWCLK_DEBUG -44.45,24.13; SWDIO_DEBUG -46.99,24.13 | drill 0.7 pad 1.676 square: MISO_ICSP -11.43,10.16
SOIC-8 = smd 1.27 x 0.635: CANH 2.54,0.635; CANL 2.54,-0.635; RS 2.54,1.905; RXD -2.54,-1.905; TXD -2.54,1.905; VDD -2.54,-0.635; VREF 2.54,-1.905; VSS -2.54,0.635
TRIMPOT-PTH-3386U = drill 1.016 pad 1.88 square: 1 -2.54,-0.015 | drill 1.016 pad 1.88: 2 0,-0.015; 3 2.54,-0.015

### Placement (x,y rotation side)
ALPHAN_DISP  99.07,9.79 90 top
AUX_IO  99.01,46.73 270 top
BACKUP_CAM  64.77,81.15 0 top
BACKUP_CAM_SW  80.64,81.41 0 top
BPS_DISPLAY  3.65,62.76 270 top
BPS_INDIC  21.72,76.83 180 top
BUZZER  59.69,81.15 180 top
C1  90.42,4.57 90 top
C2  84.13,4.97 90 top
C3  97.41,4.57 90 top
C4  71.5,11.68 0 top
C5  36.07,80.64 270 top
C6  42.55,80.77 90 top
CAM_VID  75.18,81.31 0 top
CAN_OUTPUT  5.17,9.7 270 top
GPS_MODUL  53.98,76.33 180 top
IC1  26.16,8.64 270 top
IC2  51.18,8.51 270 top
JP1  19.68,81.79 90 top
LEFT_INDIC  89.03,81.41 0 top
LIGHT_SW_BAR  98.93,75.82 180 top
POWER  14.88,5.34 90 top
R1  26.67,72.39 90 top
R2  24.13,72.39 90 top
R3  21.59,72.39 90 top
R4  19.05,72.39 90 top
R5  16.51,72.39 90 top
R6  50.67,81.92 180 top
R7  24.77,81.79 0 top
R8  29.97,81.79 0 top
R9  13.21,80.01 0 top
R10  8.32,60.29 180 top
RIGHT_INDIC  96.52,81.28 0 top
STEERING  98.96,50.09 90 top
U$1  67.75,38.26 0 top
U$2  71.93,4.84 180 top
VR1  5.66,76.77 0 top

### Tracks (layer width: path | path; a pad name or v marks a point on that pad's centre or on a via)
5V  (via drill 0.51)
  Top 0.254: ALPHAN_DISP.4 99.21,17.6 99.21,19.89 ALPHAN_DISP.5 | 74.3,5.49 U$2.VDD 73.27,5.47 73.24,5.5 70.35,8.62 70.23,8.76 C4.1 | v9.37,50.98 9.37,60.12 R10.1 | v22.17,38.18 22.17,29.26 30.86,20.57 U$1.5V
  Bottom 0.254: ALPHAN_DISP.4 99.21,17.37 99.21,16.69 100.36,15.54 100.36,9.27 99.54,8.46 83.69,8.84 77.72,13.03 71.55,13.03 70.41,11.89 C4.1 70.18,11.89 65.25,11.89 62,15.77 35.66,15.77 31.09,20.34 U$1.5V | v22.17,38.18 v9.37,50.98
CAM_VID
  Top 0.254: BACKUP_CAM.2 67.89,81.15 69.27,82.53 73.84,82.53 74.98,81.38 CAM_VID.1
DB4
  Bottom 0.254: U$1.30 86.64,56.01 31.09,56.01 21.49,46.41 15.09,46.41 9.6,51.89 5.49,51.89 BPS_DISPLAY.6
DB5
  Top 0.254: U$1.29 89.15,58.52 88.47,58.52 87.33,57.38 62.64,57.38 52.35,67.67 52.35,69.95 51.66,70.64 50.75,70.64 50.06,69.95 50.06,60.58 51.21,59.44 51.21,58.29 42.52,49.61 6.63,49.61 3.66,52.58 BPS_DISPLAY.5
DB6  (via drill 0.51)
  Top 0.254: BPS_DISPLAY.4 8.74,50.06 41.83,50.06 v50.29,58.52
  Bottom 0.254: v50.29,58.52 86.64,58.52 U$1.28
DB7  (via drill 0.51)
  Top 0.254: v61.27,59.89 87.33,59.89 88.47,61.04 89.15,61.04 U$1.27 | v49.61,59.89 11.66,59.89 10.06,61.49 8.69,61.49 8.23,61.04 8.23,59.44 6.63,57.84 3.66,57.84 BPS_DISPLAY.3
  Bottom 0.254: v49.61,59.89 v61.27,59.89
DISP_RX
  Bottom 0.254: U$1.A0 43.66,20.57 45.49,22.4 88.92,22.4 98.98,12.34 ALPHAN_DISP.2
DISP_TX
  Bottom 0.254: U$1.A1 46.18,20.34 50.29,16.23 92.58,16.23 98.98,9.83 ALPHAN_DISP.1
FILTERED_SUPPLY  (via drill 0.51)
  Top 0.254: LIGHT_SW_BAR.6 86.41,75.89 86.87,75.89 88.24,77.27 99.44,77.27 100.36,76.35 100.36,69.27 98.98,67.89 STEERING.8 | GPS_MODUL.8 36.12,76.12 36.12,67.67 33.6,65.15 13.26,65.15 3.2,75.21 3.2,76.58 VR1.1 | C3.1 97.38,3.43 90.53,3.43 C1.1 90.3,3.2 89.15,2.06 84.12,2.06 C2.+ | 21.26,26.98 3.66,26.98 BPS_DISPLAY.15 | 21.26,26.98 21.95,26.98 28.35,20.57 U$1.3V3 | 21.26,26.98 v21.26,47.32
  Bottom 0.254: 40.69,66.75 44.12,66.75 44.81,67.44 44.81,69.72 46.18,71.09 80.92,71.09 85.5,74.02 86.18,74.02 LIGHT_SW_BAR.6 | 40.69,66.75 39.78,67.67 39.78,72.69 36.35,76.12 GPS_MODUL.8 | C2.+ 83.13,2.44 74.02,2.31 61.39,14.94 32.97,14.81 28.57,20.34 U$1.3V3 | v21.26,47.32 40.69,66.75
  pour Bottom: 0,0 103.38,0 103.38,86.36 0,86.36
GND  (via drill 0.51)
  Top 0.254: VR1.3 8.23,76.81 13.95,76.81 BPS_INDIC.4 14.17,77.04 14.86,77.04 17.14,79.32 35.89,79.32 C5.2 36.12,79.55 37.95,79.55 40.23,81.84 42.52,81.84 C6.2 42.75,81.84 48.01,81.84 49.15,80.7 50.52,80.7 51.66,81.84 R6.1 51.89,81.84 56.46,81.84 BUZZER.2 | BACKUP_CAM_SW.2 83.21,81.61 87.33,81.61 88.47,82.75 90.3,82.75 91.44,81.61 LEFT_INDIC.2 91.67,81.61 92.81,82.75 96.93,82.75 98.3,81.38 98.98,81.38 RIGHT_INDIC.2 | v81.61,77.5 83.21,75.89 83.67,75.89 LIGHT_SW_BAR.7 | 69.04,11.38 69.04,12.12 69.95,13.03 71.55,13.03 72.69,11.89 C4.2 | 69.04,11.38 69.04,9.37 73.19,4.89 73.65,4.41 74.3,4.34 U$2.VSS | ALPHAN_DISP.3 98.98,14.86 98.98,14.17 97.61,12.8 97.61,5.94 C3.2 97.38,5.94 90.53,5.94 C1.2 90.3,5.94 89.15,7.09 84.12,7.09 C2.- | IC2.GND 45.95,7.77 40.46,7.77 37.49,4.8 15.54,4.8 15.09,5.26 POWER.1 14.86,5.49 3.66,16.69 3.66,24.46 BPS_DISPLAY.16 3.43,24.69 3.43,25.6 2.29,26.75 2.29,33.6 3.43,34.75 BPS_DISPLAY.12 3.43,34.98 2.29,36.12 2.29,60.81 3.43,61.95 3.43,62.64 BPS_DISPLAY.1 | v57.84,11.38 69.04,11.38
  Bottom 0.254: BPS_DISPLAY.1 3.66,62.87 3.66,72.24 8,76.58 VR1.3 | 81.61,79.55 81.61,80.01 82.98,81.38 BACKUP_CAM_SW.2 | 81.61,79.55 v81.61,77.5 | C5.2 36.12,79.32 36.12,78.87 38.63,76.35 GPS_MODUL.7 | 81.61,79.55 58.75,79.55 BUZZER.2 | C4.2 72.92,11.66 78.41,11.66 82.75,7.57 C2.- | v57.84,11.38 49.94,11.38 47.07,8.51 IC2.GND
  pour Top: 0,-0.13 0,86.11 0.13,86.23 103.38,86.23 103.5,86.11 103.5,-0.13
MISO
  Top 0.254: BPS_DISPLAY.13 5.61,32.28 19.43,46.1 19.43,48.77 55.98,48.77 U$1.MISO_ICSP
MOSI
  Bottom 0.254: U$1.MOSI_ICSP 58.75,45.72 57.84,45.72 56.69,44.58 29.72,44.58 22.4,37.26 3.66,37.26 BPS_DISPLAY.11
N$1
  Top 0.254: U$1.VIN 38.41,20.34 24.23,6.17 21.26,6.17 IC1.OUT
N$2
  Top 0.254: U$1.GND_2 35.89,20.34 24.23,8.69 21.26,8.69 IC1.GND
N$3
  Top 0.254: BACKUP_CAM.1 64.92,81.15 66.98,83.21 98.98,83.21 101.27,80.92 101.27,48.31 101.22,48.26 97.41,48.26 97.41,46.99 92.46,42.04 83.44,42.04 63.75,22.35 63.75,17.91 61.59,17.91 49.66,5.97 IC2.OUT
N$4
  Top 0.254: U$1.2 51.24,66.49 62.99,54.74 96.9,54.74 STEERING.2
N$5
  Bottom 0.254: BACKUP_CAM.3 73.38,81.15 74.52,80.01 79.1,80.01 80.47,81.38 BACKUP_CAM_SW.1
N$6
  Bottom 0.254: U$1.3 48.69,68.58 48.69,58.98 50.52,57.15 96.93,57.15 98.75,55.32 STEERING.3
N$7
  Bottom 0.254: U$1.4 46.18,68.81 48.01,70.64 57.15,70.64 68.12,59.66 96.93,59.66 98.75,57.84 STEERING.4
N$8
  Bottom 0.254: U$1.5 43.66,68.81 43.66,69.27 48.92,74.52 80.47,74.52 83.21,77.27 99.44,77.27 100.36,76.35 100.36,71.09 97.61,68.35 97.61,61.49 98.75,60.35 STEERING.5
N$9
  Bottom 0.254: U$1.6 41.15,68.81 47.32,74.98 80.24,74.98 82.98,77.72 99.67,77.72 100.81,76.58 100.81,64.69 98.98,62.87 STEERING.6
N$10
  Top 0.254: U$1.7 38.63,68.81 38.63,74.3 40.01,75.67 40.01,77.04 41.15,78.18 81.15,78.18 81.38,78.41 98.98,78.41 100.81,76.58 100.81,67.21 98.98,65.38 STEERING.7
N$12
  Top 0.254: R1.2 26.75,73.38 28.8,73.38 33.6,78.18 39.55,78.18 42.06,80.7 48.46,80.7 49.38,79.78 87.33,79.78 88.92,81.38 LEFT_INDIC.1
N$13  (via drill 0.51)
  Top 0.254: v29.26,78.41 24.23,73.38 R2.2
  Bottom 0.254: v29.26,78.41 30.86,78.41 36.12,83.67 94.18,83.67 96.47,81.38 RIGHT_INDIC.1
N$14
  Top 0.254: R1.1 26.75,71.32 32,71.32 34.52,68.81 U$1.8
N$15
  Top 0.254: R2.1 24.23,71.32 24.92,70.64 25.15,70.64 25.83,69.95 25.83,67.67 26.75,66.75 30.18,66.75 32,68.58 U$1.9
N$16
  Top 0.254: BPS_INDIC.1 21.72,73.38 R3.2
N$17
  Top 0.254: R4.2 18.97,73.38 18.97,76.81 BPS_INDIC.2
N$18
  Top 0.254: R5.2 16.46,73.38 16.46,76.81 BPS_INDIC.3
N$19  (via drill 0.51)
  Top 0.254: v21.95,66.52 20.8,67.67 20.8,69.95 21.49,70.64 21.49,71.32 R3.1
  Bottom 0.254: v21.95,66.52 27.43,66.52 29.49,68.58 U$1.10
N$20  (via drill 0.51)
  Top 0.254: v20.34,74.52 20.34,72.69 19.2,71.55 R4.1
  Bottom 0.254: v20.34,74.52 20.34,70.18 20.8,69.72 20.8,66.52 21.72,65.61 29.03,65.61 30.86,67.44 30.86,69.95 30.18,70.64 29.03,70.64 27.2,68.81 U$1.11
N$21
  Top 0.254: R5.1 16.69,71.32 18.29,69.72 18.29,67.44 20.12,65.61 22.17,65.61 24.46,67.89 24.46,68.58 U$1.12
N$22
  Top 0.254: U$2.TXD 74.52,2.97 74.98,3.43 75.21,3.43 84.12,12.34 84.12,20.34 U$1.CANTX
N$23
  Top 0.254: U$2.RXD 74.52,6.86 74.52,13.26 81.61,20.34 U$1.CANRX
N$24
  Top 0.254: U$2.RS 69.49,2.74 73.15,2.74 73.61,2.29 76.12,2.29 96.24,22.4 99.44,22.4 101.73,24.69 101.73,81.15 99.21,83.67 51.44,83.67 49.84,82.07 R6.2
N$25
  Top 0.254: R7.1 23.55,81.84 21.03,81.84 JP1.1
N$26
  Top 0.254: R8.1 28.8,81.84 25.83,81.84 R7.2 25.6,81.84 25.6,83.67 7.54,83.67 1.83,77.95 1.83,13.26 CAN_OUTPUT.1 3.61,8.17 3.61,4.28 3.63,3.17 47.09,3.2 48.01,4.12 69.27,4.12 U$2.CANH
N$27
  Top 0.254: U$2.CANL 69.27,5.26 63.55,5.26 62.87,4.57 47.78,4.57 47.09,3.89 6.17,3.89 CAN_OUTPUT.2 | R9.1 12.19,80.03 12.19,81.79 JP1.2
  Bottom 0.254: JP1.2 18.29,81.61 5.49,81.61 1.83,77.95 1.83,8.23 4.31,5.75 CAN_OUTPUT.2
N$28
  Top 0.254: R8.2 31.09,81.84 35.89,81.84 C5.1
N$29  (via drill 0.51)
  Top 0.254: v37.95,80.7 35.66,80.7 34.98,80.01 R9.2
  Bottom 0.254: v37.95,80.7 41.38,80.7 42.52,79.55 C6.1
N$30
  Bottom 0.254: U$1.13 22.17,68.81 34.06,80.7 36.8,80.7 39.32,83.21 57.61,83.21 59.66,81.15 BUZZER.1
N$31
  Top 0.254: U$1.TX0 53.72,68.81 53.72,69.27 48.46,74.52 42.98,74.52 41.38,76.12 GPS_MODUL.6
N$32
  Top 0.254: U$1.RX0 56.24,68.81 50.06,74.98 45.03,74.98 43.89,76.12 GPS_MODUL.5
N$33
  Top 0.254: R10.2 7.32,60.35 3.66,60.35 BPS_DISPLAY.2
N$34
  Bottom 0.254: BPS_DISPLAY.14 3.43,29.95 3.43,30.63 2.29,31.77 2.29,73.38 5.49,76.58 VR1.2
N$35
  Top 0.254: U$1.22 88.11,64.9 90.81,64.9 98.93,73.03 LIGHT_SW_BAR.1
N$36
  Top 0.254: U$1.23 96.39,73.25 LIGHT_SW_BAR.2
N$37
  Bottom 0.254: U$1.24 86.87,63.55 87.78,63.55 88.92,62.41 89.84,62.41 93.73,66.29 93.73,75.67 LIGHT_SW_BAR.3
N$38
  Bottom 0.254: U$1.25 89.38,63.78 89.38,64.69 91.21,66.52 91.21,75.67 LIGHT_SW_BAR.4
N$39
  Top 0.254: U$1.26 86.64,61.27 86.64,62.18 85.5,63.32 85.5,72.47 88.7,75.67 LIGHT_SW_BAR.5
N$40
  Top 0.254: U$1.53 89.38,27.89 95.1,27.89 98.98,24 AUX_IO.10
N$41
  Bottom 0.254: U$1.52 86.87,27.89 88.01,27.89 89.15,26.75 98.75,26.75 98.98,26.52 AUX_IO.9
N$42
  Top 0.254: U$1.51 89.38,30.63 97.38,30.63 98.98,29.03 AUX_IO.8
N$43
  Top 0.254: U$1.50 86.87,30.86 88.01,30.86 88.92,31.77 98.75,31.77 98.98,31.55 AUX_IO.7
N$44
  Top 0.254: U$1.49 89.38,33.38 98.53,33.38 98.98,33.83 AUX_IO.6
N$45
  Top 0.254: U$1.48 86.87,33.38 87.78,33.38 88.92,34.52 97.16,34.52 98.98,36.35 AUX_IO.5
N$46
  Top 0.254: U$1.47 89.38,35.89 95.78,35.89 98.98,39.09 AUX_IO.4
N$47
  Top 0.254: U$1.46 86.87,35.89 87.78,35.89 88.92,37.03 94.41,37.03 98.98,41.6 AUX_IO.3
N$48
  Top 0.254: U$1.45 89.38,38.41 93.27,38.41 98.98,44.12 AUX_IO.2
N$49
  Top 0.254: U$1.44 86.87,38.41 87.78,38.41 88.92,39.55 91.9,39.55 98.98,46.63 AUX_IO.1
VIN
  Top 0.254: IC1.IN 21.03,10.97 18.06,10.97 15.09,8 POWER.2
  Bottom 0.254: IC2.IN 46.08,10.52 41.33,10.52 39.88,12.85 22.4,12.85 21.26,11.2 IC1.IN

### Text on the board
tOrigins: Dashboard_RevD | Shawn Victor | Armin Taher | Jacob Stokes